# EAGLE design cgm monitor (EAGLE 9.3.2)
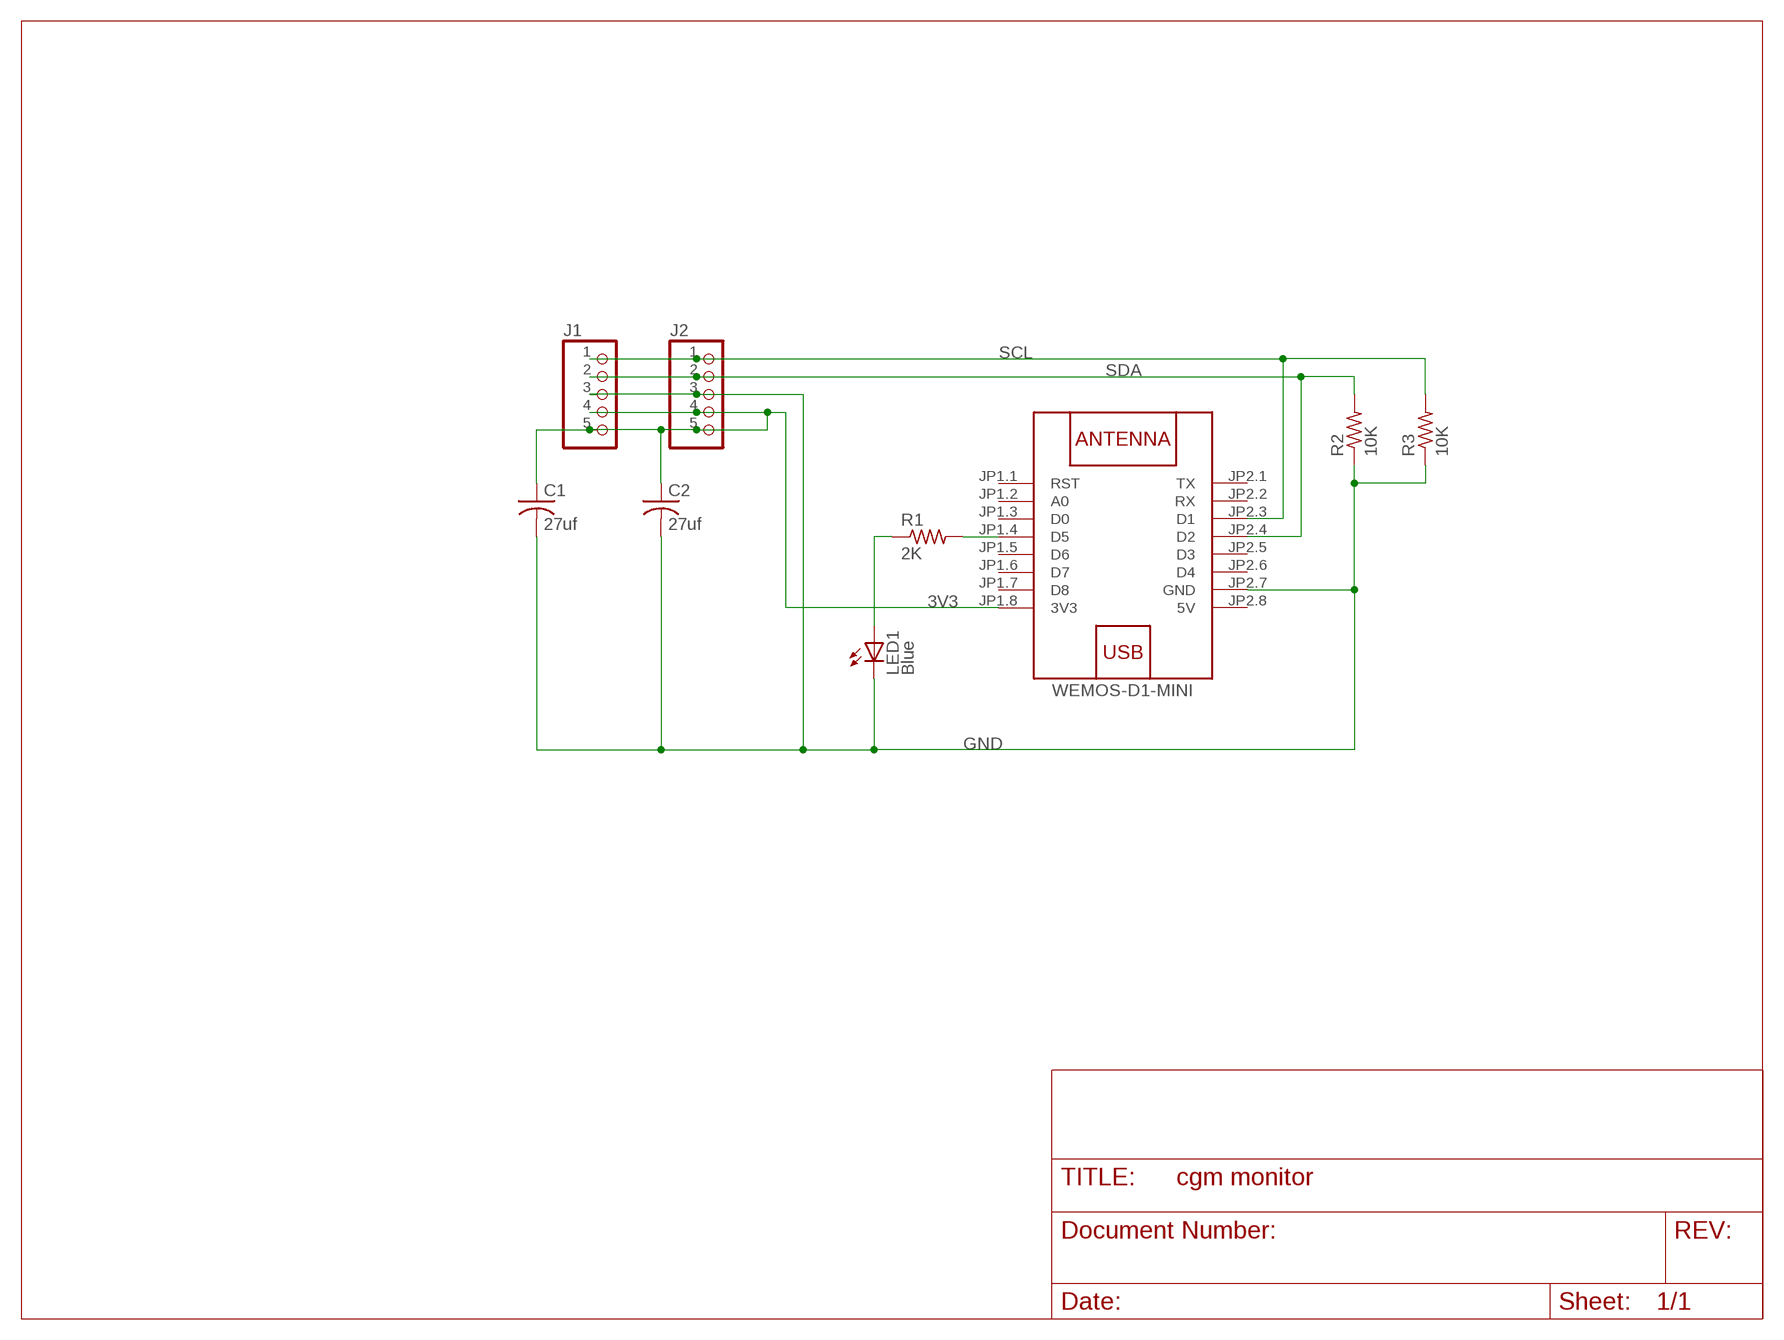
[diagram p0: schematic, sheet 1]

## Parts
C1  27uf  C-US050-050X075  [C050-050X075]
C2  27uf  C-US050-050X075  [C050-050X075]
J1  PINHD-1X5  [1X05]
J2  PINHD-1X5  [1X05]
LED1  Blue  LED5MM  [LED5MM]
R1  2K  R-US_0207/9  [0207/9]
R2  10K  R-US_0207/9  [0207/9]
R3  10K  R-US_0207/9  [0207/9]
W1  WEMOS-D1-MINI  [WEMOS-D1-MINI]

## Nets
3V3: C1.1 C2.1 J1.4 J1.5 J2.4 J2.5 W1.JP1.8(3V3)
GND: C1.2 C2.2 J1.3 J2.3 LED1.K(C) R2.1 R3.1 W1.JP2.7(GND)
N$3: R1.2 W1.JP1.4(D5)
N$4: LED1.A R1.1
SCL: J1.1 J2.1 R3.2 W1.JP2.3(D1)
SDA: J1.2 J2.2 R2.2 W1.JP2.4(D2)
Unconnected: W1.JP1.1(RST) W1.JP1.2(A0) W1.JP1.3(D0) W1.JP1.5(D6) W1.JP1.6(D7) W1.JP1.7(D8) W1.JP2.1(TX) W1.JP2.2(RX) W1.JP2.5(D3) W1.JP2.6(D4)

## Power pins joined to a net without a drawn wire
5V: W1.JP2.8(5V)

## Library data of the parts
C1 C2 = adafruit:C-US: CAPACITOR, American symbol
J1 J2 = myParts:PINHD-1X5
LED1 = adafruit:LED: LED OSRAM: - CHIPLED LG R971, LG N971, LY N971, LG Q971, LY Q971, LO R971, LY R971 LH N974, LH R974 LS Q976, LO Q976, LY Q976 LO Q996 - Hyper CHIPLED LW Q18S LB Q993, LB Q99A, LB R99A - SideLED LS A670, LO A670, LY A670, LG A670, LP A670 LB A673, LV A673, LT A673, LW A673 LH A674 LY A675 LS A676, LA A676, LO A676, LY A676, LW A676 LS A679, LY A679, LG A679 - Hyper Micro SIDELED® LS Y876, LA Y876, LO Y876, LY Y876 LT Y87S - SmartLED LW L88C, LW L88S LB L89C, LB L89S, LG L890 LS L89K, LO L89K, LY L89K LS L896, LA L896, LO L896, LY L896 - TOPLED LS T670, LO T670, LY T670, LG T670, LP T670 LSG T670, LSP T670, LSY T670, LOP T670, LYG T670 LG T671, LOG T671, LSG T671 LB T673, LV T673, LT T673, LW T673 LH T674 LS T676, LA T676, LO T676, LY T676, LB T676, LH T676, LSB T676, LW T676 LB T67C, LV T67C, LT T67C, LS T67K, LO T67K, LY T67K, LW E67C LS E67B, LA E67B, LO E67B, LY E67B, LB E67C, LV E67C, LT E67C LW T67C LS T679, LY T679, LG T679 LS T770, LO T770, LY T770, LG T770, LP T770 LB T773, LV T773, LT T773, LW T773 LH T774 LS E675, LA E675, LY E675, LS T675 LS T776, LA T776, LO T776, LY T776, LB T776 LHGB T686 LT T68C, LB T68C - Hyper Mini TOPLED® LB M676 - Mini TOPLED Santana® LG M470 LS M47K, LO M47K, LY M47K Source: http://www.osram.convergy.de/
R1-R3 = adafruit:R-US_: RESISTOR, American symbol
W1 = diy-modules:WEMOS-D1-MINI: WEMOS D1 mini: Mini Wi-Fi Board based on ESP-8266 device More details can be found here: https://www.wemos.cc/product/d1-mini.html Click here to find device on ebay.com <http://www.ebay.com/sch/wemos+d1+mini+nodemcu>

## Board
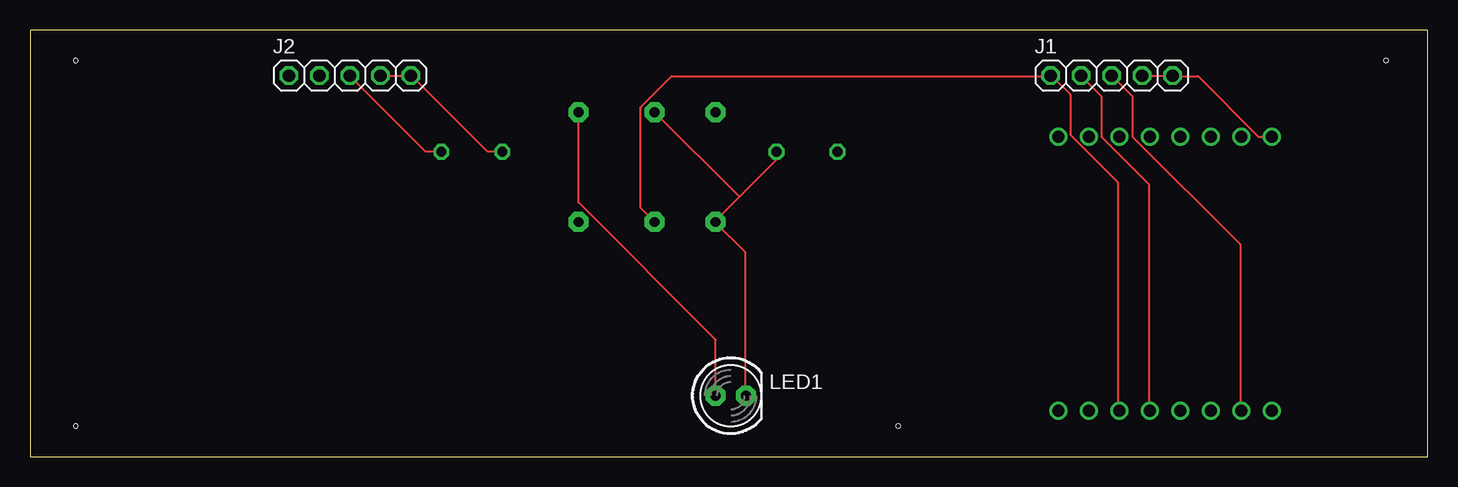
[diagram p1: board, top side]
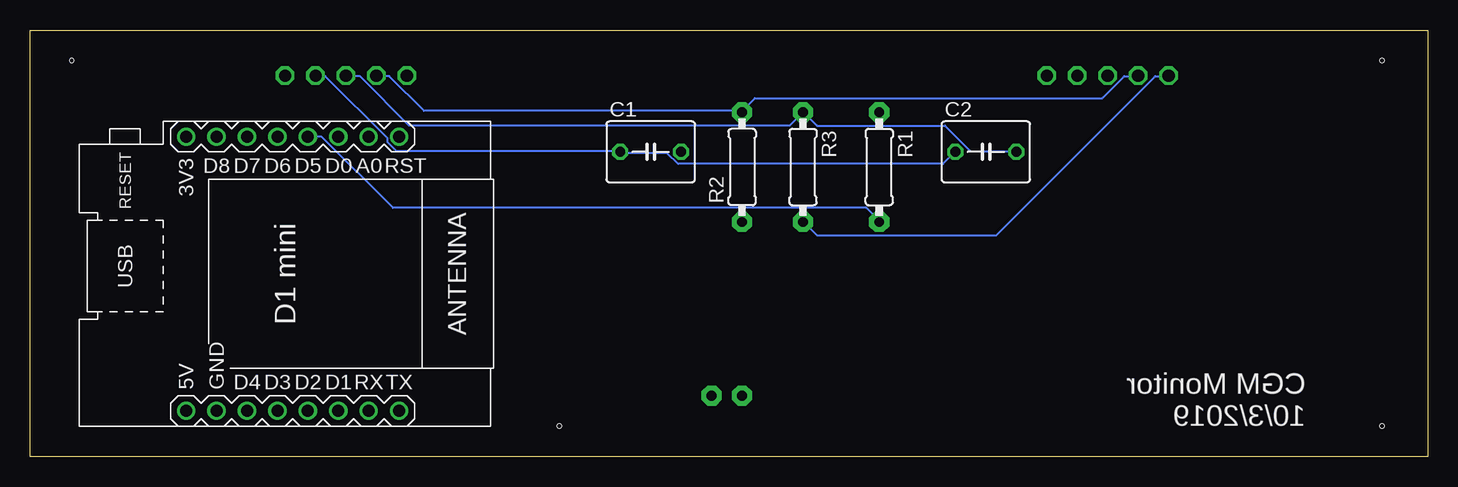
[diagram p2: board, bottom side, seen from below]

Size 116.51 x 35.55 mm. Coordinates in mm from the lower left corner, seen from the top.
Outline: 0,0 116.51,0 116.51,35.55 0,35.55 0,0
Copper layers (1*16): Top 0.035mm / dielectric 1.5mm / Bottom 0.035mm
Design rules "default": minimum track width 6mil, minimum drill 0.35mm, track to track 6mil, track to pad 6mil, pad to pad 6mil, via to via 6mil, smd to smd 6mil, copper to edge 40mil, drill to drill 6mil, minimum pad ring 10mil, minimum via ring 8mil, stop-mask expansion 4mil, vias tented up to drill 0mil, thermal gap 10mil
Holes 0.35 mm at 3.81,2.54 3.81,33.02 113.03,33.02 72.39,2.54

### Footprints (pad centres in the part's own frame; a part is rotated, then mirrored left to right if it is on the bottom)
C050-050X075 = drill 0.813 octagon: 1 -2.54,0; 2 2.54,0
1X05 = drill 1.016 octagon: 1 -6.35,0; 2 -3.81,0; 3 -1.27,0; 4 1.27,0; 5 3.81,0
LED5MM = drill 0.813 pad 1.676 octagon: A -1.27,0; K 1.27,0
0207/9 = drill 0.813 pad 1.676 octagon: 1 -4.572,0; 2 4.572,0
WEMOS-D1-MINI = drill 1: JP1.1 -11.43,9.525; JP1.2 -11.43,6.985; JP1.3 -11.43,4.445; JP1.4 -11.43,1.905; JP1.5 -11.43,-0.635; JP1.6 -11.43,-3.175; JP1.7 -11.43,-5.715; JP1.8 -11.43,-8.255; JP2.1 11.43,9.525; JP2.2 11.43,6.985; JP2.3 11.43,4.445; JP2.4 11.43,1.905; JP2.5 11.43,-0.635; JP2.6 11.43,-3.175; JP2.7 11.43,-5.715; JP2.8 11.43,-8.255

### Placement (x,y rotation side)
C1  64.77,25.4 0 bottom
C2  36.83,25.4 0 bottom
J1  91.44,31.75 0 top
J2  27.94,31.75 0 top
LED1  58.42,5.08 0 top
R1  45.72,24.13 270 bottom
R2  57.15,24.13 90 bottom
R3  52.07,24.13 270 bottom
W1  95.25,15.24 270 bottom

### Tracks (layer width: path | path; a pad name or v marks a point on that pad's centre or on a via)
3V3
  Top 0.152: W1.JP1.8 102.41,26.67 97.38,31.7 95.25,31.7 | 95.25,31.7 92.81,31.7 J1.4 | 95.25,31.7 J1.5 | C2.1 39.32,25.45 38.1,25.45 31.85,31.7 J2.5 31.7,31.7 29.26,31.7 J2.4
  Bottom 0.152: C2.1 40.39,24.38 62.48,24.38 63.4,25.3 67.21,25.3 C1.1 67.36,25.45 85.95,25.45 86.72,26.21 86.72,26.52 91.9,31.7 92.66,31.7 J1.4
GND
  Top 0.152: J1.3 91.9,30.02 91.9,26.67 100.89,17.68 100.89,3.81 W1.JP2.7 | C2.2 34.29,25.45 32.92,25.45 26.67,31.7 J2.3 | 59.13,21.64 57.15,19.66 R2.1 57.15,19.51 59.59,17.07 59.59,5.18 LED1.K | 59.13,21.64 62.18,24.69 62.18,25.3 C1.2 | 59.13,21.64 R3.1
  Bottom 0.152: C2.2 34.29,25.45 38.1,25.45 40.23,27.58 50.9,27.58 51.97,28.65 R3.1 53.19,27.58 84.89,27.58 89,31.7 90.07,31.7 J1.3
N$3
  Bottom 0.152: W1.JP1.4 92.2,26.67 86.26,20.73 46.79,20.73 45.72,19.66 R1.2
N$4
  Top 0.152: R1.1 45.72,21.18 57.15,9.75 LED1.A
SCL
  Top 0.152: W1.JP2.3 90.68,3.81 90.68,22.86 86.72,26.82 86.72,30.18 85.19,31.7 J1.1 85.04,31.7 53.49,31.7 50.9,29.11 50.9,20.73 R3.2
  Bottom 0.152: J2.1 21.64,31.7 22.71,31.7 35.97,18.44 50.9,18.44 51.97,19.51 R3.2
SDA
  Top 0.152: W1.JP2.4 93.27,3.81 93.27,22.71 89.31,26.67 89.31,30.02 87.63,31.7 J1.2
  Bottom 0.152: 57.15,28.8 56.08,29.87 27.13,29.87 25.3,31.7 24.23,31.7 J2.2 | 57.15,28.8 83.67,28.8 86.56,31.7 87.63,31.7 J1.2 | 57.15,28.8 R2.2

### Text on the board
bNames: CGM Monitor / 10/3/2019